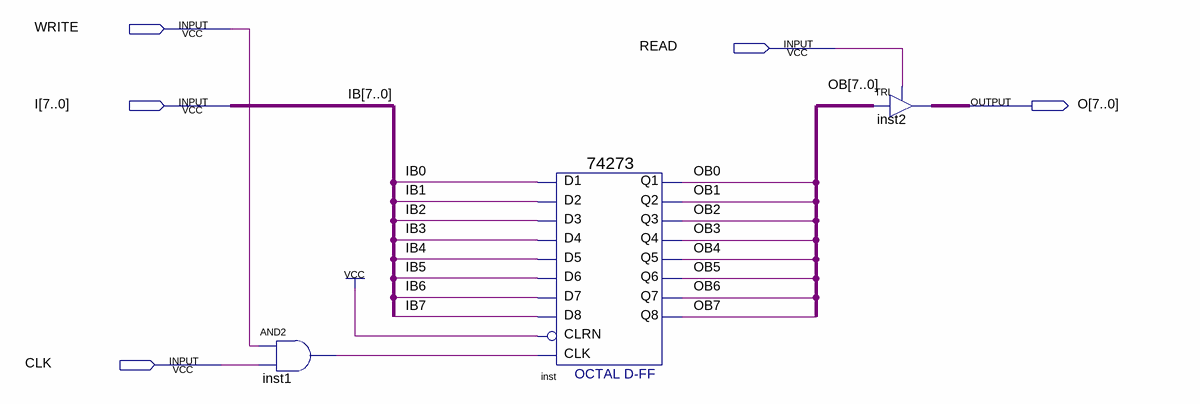
[diagram p0: schematic sheet]
// Quartus schematic REG8-TRI-B.bdf as structural Verilog: 3 symbols, 5 pins
module \REG8-TRI-B  (
  input  WRITE,
  input  READ,
  input  [7:0] I,
  input  CLK,
  output [7:0] O
);

  wire inst1_out;
  wire [7:0] OB;

  and inst1 (inst1_out, WRITE, CLK);
  \74273  inst (
    .D2(I[1]), .D3(I[2]), .D1(I[0]), .D4(I[3]), .D7(I[6]), .D6(I[5]), .D5(I[4]), .D8(I[7]), .CLK(inst1_out),
    .CLRN(1'b1), .Q4(OB[3]), .Q1(OB[0]), .Q2(OB[1]), .Q3(OB[2]), .Q6(OB[5]), .Q5(OB[4]), .Q7(OB[6]),
    .Q8(OB[7]));
  TRI inst2[7:0] (.IN(OB), .OE(READ), .OUT(O));

  // Other names for the same wires on the sheet: IB[7:0] = I; IB0 = I[0]; IB1 = I[1]; IB2 = I[2]; IB3 = I[3];
  //   IB4 = I[4]; IB5 = I[5]; IB6 = I[6]; IB7 = I[7]
endmodule
